# EAGLE design LED_driver_1_2 (EAGLE 6.6.0)
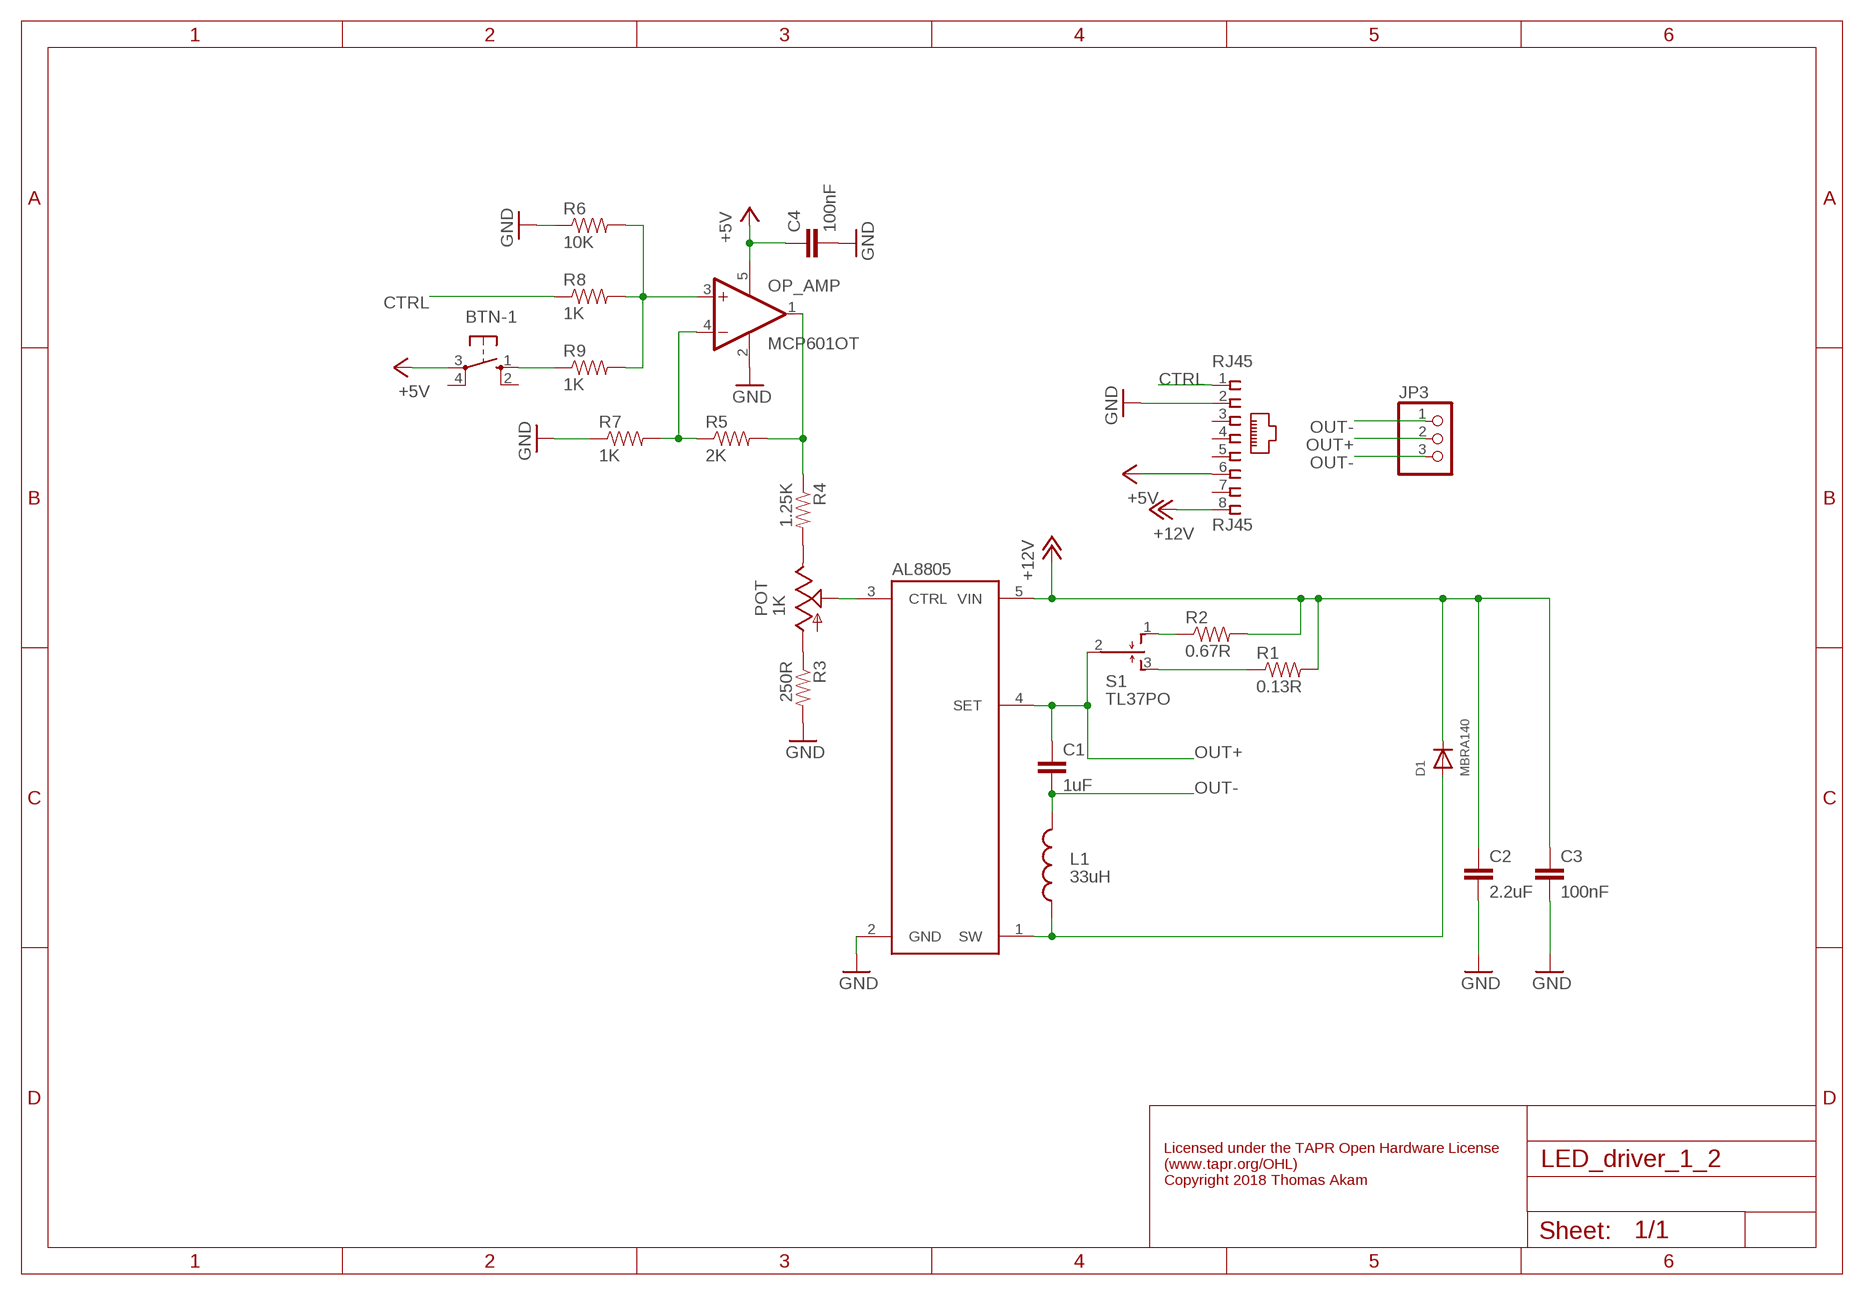
[diagram p0: schematic, sheet 1]

## Parts
AL8805  AL8805  [SOT23-5]
BTN-1  10-XX  [B3F-10XX]
C1  1uF  C-EUC0805  [C0805]
C2  2.2uF  C-EUC0805  [C0805]
C3  100nF  C-EUC0805  [C0805]
C4  100nF  C-EUC0805  [C0805]
D1  MBRA140  DIODESOD-123  [SOD-123]
JP3  PINHD-1X3  [1X03]
L1  33uH  INDUCTORBOURNS_SRN6045  [SRN6045]
OP_AMP  MCP601OT  [SOT23-5]
POT  1K  TRIM_US-RS3  [RS3]
R1  0.13R  0.3OHM-1/8W-1%(0805)  [0805]
R2  0.67R  0.3OHM-1/8W-1%(0805)  [0805]
R3  250R  0.3OHM-1/8W-1%(0805)  [0805]
R4  1.25K  0.3OHM-1/8W-1%(0805)  [0805]
R5  2K  0.3OHM-1/8W-1%(0805)  [0805]
R6  10K  0.3OHM-1/8W-1%(0805)  [0805]
R7  1K  0.3OHM-1/8W-1%(0805)  [0805]
R8  1K  0.3OHM-1/8W-1%(0805)  [0805]
R9  1K  0.3OHM-1/8W-1%(0805)  [0805]
RJ45  RJ45  RJ45VERTICAL  [RJ45-NO-SHIELD-VERTICAL]
S1  TL37PO  [TL3XPO]

## Nets
+5V: BTN-1.3(P) C4.1 OP_AMP.5(V+) RJ45.6
+12V: AL8805.5(VIN) C2.1 C3.1 D1.C R1.2 R2.2 RJ45.8
CTRL: R8.1 RJ45.1
GND: AL8805.2(GND) C2.2 C3.2 C4.2 OP_AMP.2(V-) R3.2 R6.1 R7.1 RJ45.2
N$1: AL8805.3(CTRL) POT.S
N$2: POT.A R3.1
N$3: POT.E R4.2
N$4: R2.1 S1.1(O)
N$5: R1.1 S1.3(S)
N$6: OP_AMP.1(OUT) R4.1 R5.2
N$7: OP_AMP.4(-IN) R5.1 R7.2
N$8: OP_AMP.3(+IN) R6.2 R8.2 R9.2
N$10: BTN-1.1(S) R9.1
OUT+: AL8805.4(SET) C1.1 JP3.2 S1.2(P)
OUT- [power]: C1.2 JP3.1 JP3.3 L1.2
SW: AL8805.1(SW) D1.A L1.1
Unconnected: BTN-1.2(S1) BTN-1.4(P1) RJ45.3 RJ45.4 RJ45.5 RJ45.7

## Notes on the sheet
- Licensed under the TAPR Open Hardware License
  (www.tapr.org/OHL)
  Copyright 2018 Thomas Akam

## Library data of the parts
AL8805 = SparkFun-PowerIC:AL8805: Constant current LED driver PWM-able 1MHz switch freq 6V-36V Up to 1A LED current; PROD_ID: IC-11626; VALUE: AL8805WS
BTN-1 = switch-omron:10-XX: OMRON SWITCH; MPN: B3F-1000; OC_FARNELL: 176432; OC_NEWARK: 36M3542
C1-C4 = rcl:C-EU: CAPACITOR, European symbol
D1 = adafruit:DIODE: Diode SMADIODE - SMA Surface Mount Package 20V 1A Schottky Diode Digikey: 641-1014-6-ND DO-1N4148 - Through Hole Small Current Diode SOD-123 20V 1 A (.5mV Vf) Schottky Diode - Digikey: MBRX120TPMSCT-ND SOD-323 10V 570mA (.38mV Vf, 3ns) Schottky Diode - Digikey: ZLLS410CT-ND SOD-523 30V 30mA Schottky Diode (RB751S-40TE61) - Digikey: RB751S-40TE61CT-ND SOT23-R/W - SOT23 Package (R = Solder Paste/Reflow Ovens, W = Hand-Soldering) BAT54Film 40V 300mA - Digikey: 497-7162-1-ND
JP3 = pinhead:PINHD-1X3: PIN HEADER
L1 = SparkFun-Passives:INDUCTOR: Inductors Basic Inductor/Choke - 0603 and 1206. Footprints are not proven and vary greatly between part numbers. SRN6045- 33uH, 20% 1.4A SDR0403-560KL - 56uH, 10%, 500mA RMS/740mA peak; PROD_ID: NDUC-11627
OP_AMP = linear:MCP601: Single Op Amp 2.7V to 6.0V Single Supply CMOS Source: http://ww1.microchip.com/downloads/en/DeviceDoc/21314g.pdf
POT = pot:TRIM_US-: POTENTIOMETER
R1-R9 = SparkFun-Resistors:0.3OHM-1/8W-1%(0805): RES-11622; PROD_ID: RES-11622; VALUE: 0.3
RJ45 = con-tycoelectronics-vertical_RJ45:RJ45: CORCOM Modular RJ Jacks No Shield Source: www.tycoelectronics.com .. ENG_DS_1654001_1099_RJ_L_0507.pdf
S1 = switch:TL37PO: TINY SWITCH MOM OFF MOM Source: http://www2.produktinfo.conrad.com/datenblaetter/700000-724999/705152-da-01-de-Subminiaturschalter_TL_36YO.pdf

## Net classes
1 power: width 0.508 mm

## Board
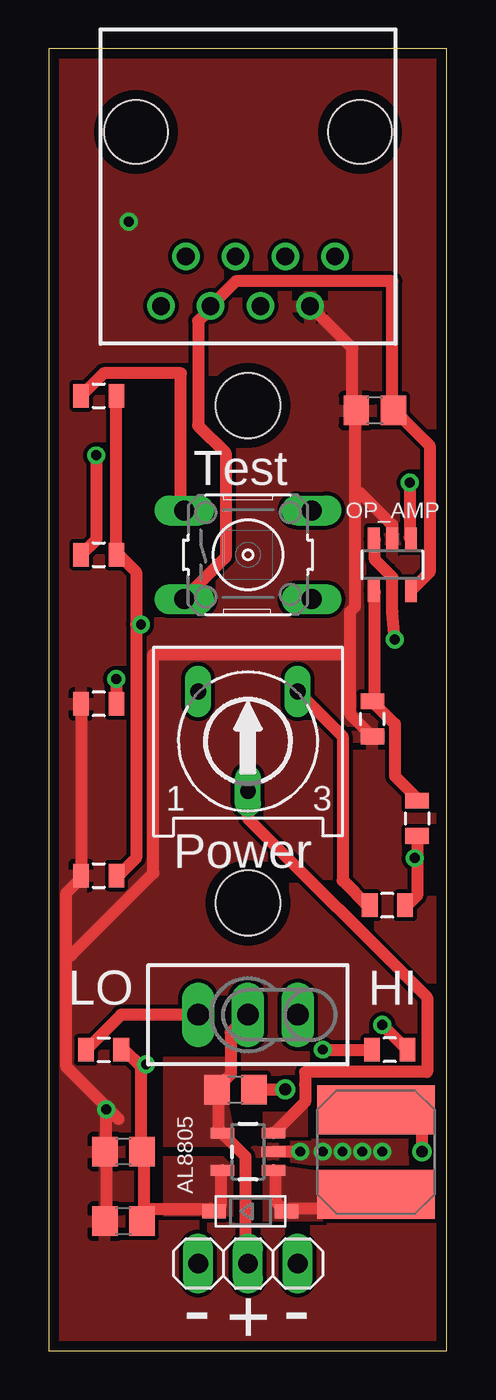
[diagram p1: board, top side]
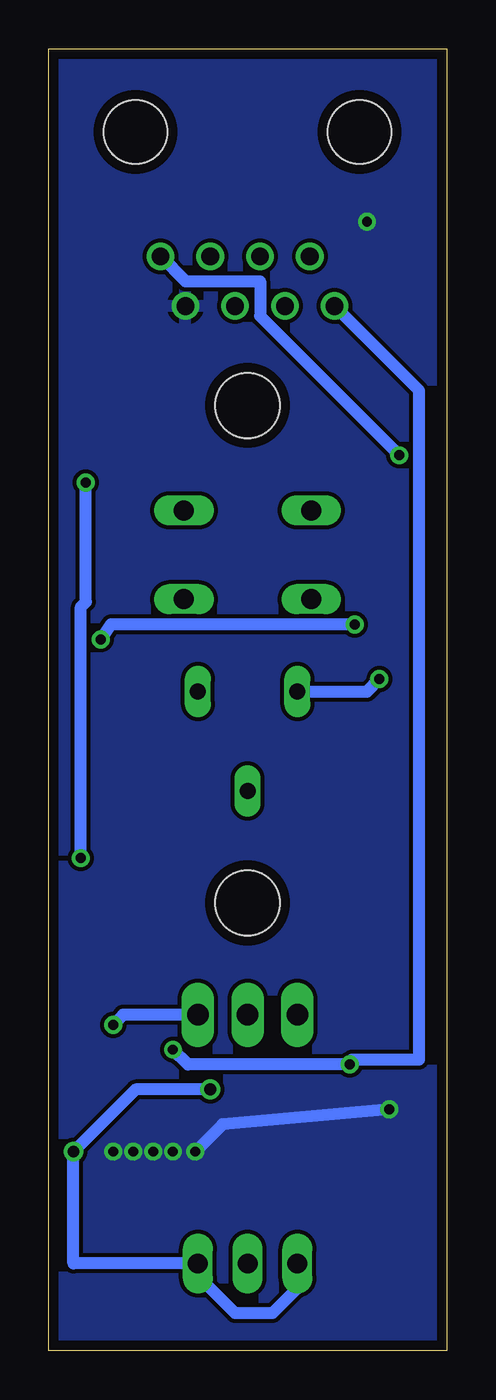
[diagram p2: board, bottom side, seen from below]

Size 20.3 x 66.47 mm. Coordinates in mm from the lower left corner, seen from the top.
Outline: 0,0 20.3,0 20.3,66.47 0,66.47 0,0
Copper layers (1*16): Top 0.035mm / dielectric 1.5mm / Bottom 0.035mm
Design rules "default *": minimum track width 20mil, minimum drill 20mil, track to track 8mil, track to pad 8mil, pad to pad 8mil, via to via 8mil, smd to smd 8mil, copper to edge 20mil, drill to drill 8mil, minimum pad ring 10mil, minimum via ring 8mil, stop-mask expansion 4mil, vias tented up to drill 0mil, thermal gap 10mil
Holes 3.3 mm at 10.16,48.26 10.16,22.86
vRestrict: area 1.9,8.3 to 5.7,9.5; area 1.9,4.4 to 5.7,5.7; area 0.6,13.3 to 4.4,14.6; area 5.1,12.7 to 7.6,14; area 15.9,13.3 to 19,14.6; area 14.6,5.1 to 17.8,6.3; area 7,0.6 to 13.3,2.5; area 6.3,7.6 to 7.6,12.1; area 15.2,21 to 19.1,22.2; area 0.6,17.1 to 4.4,19.7; area 15.9,17.1 to 19,19.7; area 15.9,26 to 17.8,27.3; 9 more areas

### Footprints (pad centres in the part's own frame; a part is rotated, then mirrored left to right if it is on the bottom)
SOT23-5 = smd 0.55 x 1.2: 1 -0.95,-1.3; 2 0,-1.3; 3 0.95,-1.3; 4 0.95,1.3; 5 -0.95,1.3
B3F-10XX = drill 1.016 long: 1 -3.251,2.261; 2 3.251,2.261; 3 -3.251,-2.261; 4 3.251,-2.261
C0805 = smd 1.3 x 1.5: 1 -0.95,0; 2 0.95,0
SOD-123 = smd 1.2 x 0.7: A 1.85,0; C -1.85,0
1X03 = drill 1.016 long: 1 -2.54,0; 2 0,0; 3 2.54,0
SRN6045 = smd 2.5 x 6: 1 -2.175,-0.175; 2 2.125,-0.175
SOT23-5' = smd 0.6 x 1.2: 1 -0.95,-1.306; 2 0,-1.306; 3 0.95,-1.306; 4 0.95,1.306; 5 -0.95,1.306
RS3 = drill 0.813 long: A -2.54,2.54; E 2.54,2.54; S 0,-2.54
0805 = smd 0.8 x 1.2: 1 -0.9,0; 2 0.9,0
RJ45-NO-SHIELD-VERTICAL = drill 0.9 pad 1.4: 1 -4.445,5.08; 2 -3.175,7.62; 3 -1.905,5.08; 4 -0.635,7.62; 5 0.635,5.08; 6 1.905,7.62; 7 3.175,5.08; 8 4.445,7.62 | hole 3.251: -5.715,-1.27; 5.715,-1.27
TL3XPO = drill 1.1 pad 1.422 long: 1 -2.54,0; 2 0,0; 3 2.54,0

### Placement (x,y rotation side)
AL8805  10.16,10.16 90 top
BTN-1  10.16,40.64 0 top
C1  9.53,13.34 0 top
C2  3.81,10.16 180 top
C3  3.81,6.6 180 top
C4  16.64,48.01 180 top
D1  10.29,7.11 0 top
JP3  10.16,4.45 0 top
L1  16.51,10.16 90 top
OP_AMP  MCP601OT  [SOT23-5']  17.53,40.13 180 top
POT  10.16,31.11 0 top
R1  2.79,15.37 0 top
R2  17.4,15.37 180 top
R3  2.54,33.02 180 top
R4  17.27,22.73 180 top
R5  18.8,27.18 270 top
R6  2.54,24.26 0 top
R7  16.51,32.26 90 top
R8  2.54,40.64 0 top
R9  2.54,48.77 0 top
RJ45  10.16,60.96 180 top
S1  10.16,17.14 180 top

### Tracks (layer width: path | path; a pad name or v marks a point on that pad's centre or on a via)
+5V
  Top 0.61: OP_AMP.5 18.54,38.86 19.43,39.75 19.43,46.23 17.65,48.01 C4.1 17.53,48.26 17.53,54.61 9.53,54.61 RJ45.6 8.13,53.09 7.62,52.58 7.62,47.24 9.02,45.85 9.02,40.51 6.99,38.48 BTN-1.3
+12V  (via drill 0.51)
  Top 0.61: AL8805.5 8.76,9.14 8.76,7.37 8.51,7.11 D1.C 8.26,7.24 5.08,7.24 C3.1 4.83,6.6 4.83,9.91 C2.1 4.7,10.16 4.7,14.48 | 4.7,14.48 3.81,15.37 R1.2 | v13.97,15.37 16.38,15.37 R2.2 | v4.95,14.61 4.7,14.48
  Bottom 0.61: v13.97,15.37 13.21,14.61 v4.95,14.61 4.83,14.86 1.4,14.86 1.4,49.02 RJ45.8
  pour Top (no thermals): 9.4,9.4 9.4,6.86 5.84,6.86 5.84,9.91 8.89,9.91
CTRL  (via drill 0.51)
  Top 0.61: v2.41,45.72 2.41,41.4 1.65,40.64 R8.1
  Bottom 0.61: v2.41,45.72 9.53,52.83 9.53,54.61 13.34,54.61 RJ45.1
GND  (via drill 0.51)
  Top 0.61: 15.37,35.56 15.37,37.72 15.62,37.97 15.62,43.81 | 15.37,35.56 15.37,32.51 R7.1 | 15.62,43.81 15.62,48.01 C4.2 15.49,48.26 15.49,51.18 RJ45.2 | OP_AMP.2 17.53,41.53 17.53,42.16 15.88,43.81 15.62,43.81 | R3.2 1.65,33.02 1.65,24.26 R6.1 1.52,24 0.89,23.37 0.89,20.19 | v12.83,10.16 11.56,10.16 AL8805.2 | C3.2 2.92,6.6 2.92,9.91 C2.2 2.92,10.16 2.92,10.79 v2.92,12.32 3.56,11.81 0.89,14.48 0.89,20.19 | 15.37,35.56 15.11,35.56 5.33,35.56 5.33,24.38 1.14,20.19 0.89,20.19
  Bottom 0.61: v12.83,10.16 11.43,11.56 v2.92,12.32
  other vias: 4.06,57.66 13.97,10.16 14.99,10.16 16,10.16 17.02,10.16
  pour Bottom (rank 2): 0,66.42 0.25,0 20.32,0 20.32,66.55
  pour Top (rank 5): 0,66.55 20.32,66.55 20.32,0 0,0
N$1
  Top 0.61: POT.S 10.16,27.18 19.3,18.03 19.3,14.22 13.08,14.22 13.08,13.59 13.08,12.7 11.56,11.18 AL8805.3
  pour Top (no thermals): 10.92,10.92 13.21,10.92 13.21,12.45 12.45,12.19 10.92,12.19
N$2  (via drill 0.51)
  Top 0.61: v3.43,34.29 3.43,33.02 R3.1
  Bottom 0.61: v3.43,34.29 4.06,33.66 POT.A
N$3
  Top 0.61: POT.E 14.99,31.37 14.99,24 16.26,22.73 R4.2
N$4  (via drill 0.51)
  Top 0.61: v17.02,16.64 18.29,15.37 R2.1
  Bottom 0.61: v17.02,16.64 16.51,17.14 S1.1
N$5
  Top 0.61: S1.3 3.68,17.14 1.91,15.37 R1.1
N$6  (via drill 0.51)
  Top 0.61: 18.8,25.15 18.8,26.16 R5.2 | 18.8,25.15 18.8,23.24 18.29,22.73 R4.1 | v18.41,44.32 18.41,41.53 OP_AMP.1 | v18.67,25.15 18.8,25.15
  Bottom 0.61: v18.41,44.32 18.41,38.23 18.67,37.97 v18.67,25.15
N$7
  Top 0.61: R5.1 18.8,28.19 17.65,29.34 17.65,32 16.51,33.15 R7.2 16.64,33.4 16.64,38.73 OP_AMP.4
N$8  (via drill 0.51)
  Top 0.61: 4.45,37.08 4.45,39.75 3.56,40.64 R8.2 3.43,40.89 3.43,48.77 R9.2 | 4.45,37.08 4.45,25.15 3.56,24.26 R6.2 | v17.65,36.32 17.53,37.72 17.53,39.5 16.64,40.39 16.64,41.4 OP_AMP.3 | v4.7,37.08 4.45,37.08
  Bottom 0.61: v17.65,36.32 17.14,37.08 v4.7,37.08
N$10
  Top 0.61: R9.1 1.65,48.77 2.79,49.91 6.73,49.91 6.73,43.05 6.86,42.93 BTN-1.1
OUT+
  Top 0.61: S1.2 9.27,16.26 9.27,14.1 8.76,13.59 C1.1 8.64,13.34 8.64,11.3 8.76,11.18 AL8805.4 9.02,10.92 10.03,9.91 10.03,4.57 JP3.2
  pour Top (no thermals): 9.14,13.97 9.14,12.7 9.4,11.43 9.4,10.41 5.84,10.41 5.84,14.99 9.14,14.99
OUT-  (via drill 0.6)
  Top 0.61: v19.05,10.16 19.05,12.06 16.68,12.06 L1.2 | C1.2 v12.06,13.34
  Bottom 0.61: JP3.1 7.62,3.17 8.89,1.91 10.79,1.91 12.7,3.81 JP3.3 19.05,4.45 v19.05,10.16 15.88,13.34 v12.06,13.34
SW
  Top 0.61: AL8805.1 11.56,9.14 11.56,7.62 12.06,7.11 D1.A 12.32,7.24 16.64,7.24 16.64,7.75 L1.1
  pour Top (no thermals): 10.92,9.4 12.19,9.4 13.97,9.14 13.97,6.6 10.92,6.6

### Text on the board
tPlace: Test | Power | LO | HI | - | - | +
Document: Licensed under the TAPR Open Hardware License / (www.tapr.org/OHL) / Copyright 2018 Thomas Akam